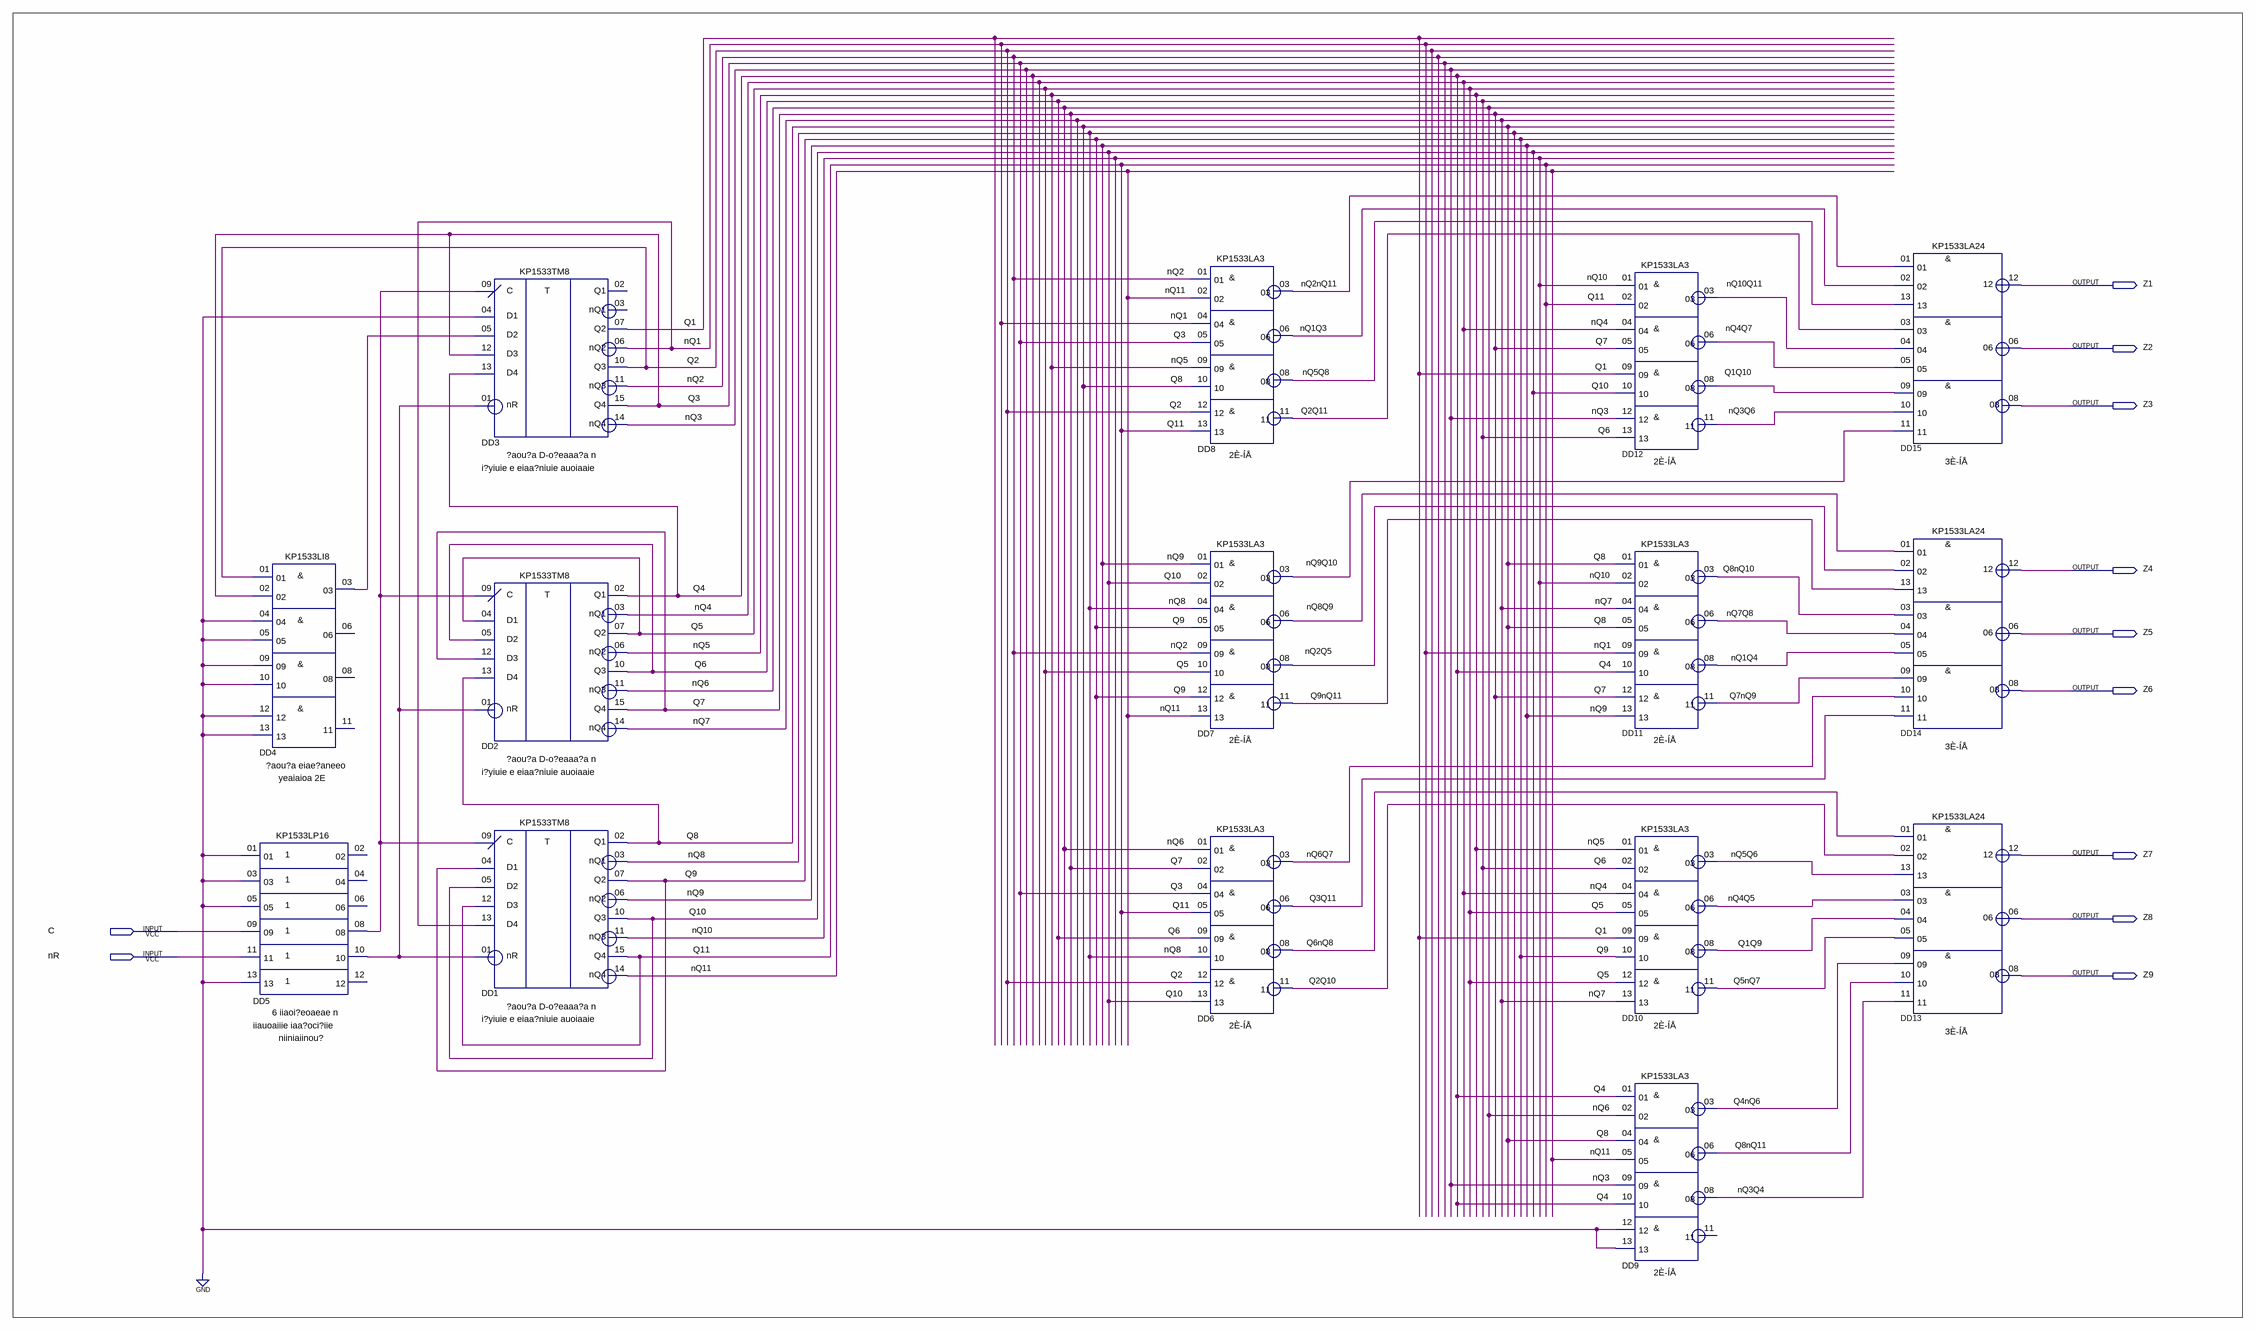
[diagram p0: schematic sheet]
// Quartus schematic PK_NAND.bdf as structural Verilog: 15 symbols, 11 pins
module PK_NAND (
  input  C,
  input  nR,
  output Z1,
  output Z2,
  output Z3,
  output Z4,
  output Z5,
  output Z6,
  output Z7,
  output Z8,
  output Z9
);

  wire DD4_03, DD5_08, DD5_10, nQ1, nQ1Q3, nQ1Q4, nQ2, nQ2nQ11, nQ2Q5, nQ3, nQ3Q4, nQ3Q6, nQ4, nQ4Q5, nQ4Q7,
       nQ5, nQ5Q6, nQ5Q8, nQ6, nQ6Q7, nQ7, nQ7Q8, nQ8, nQ8Q9, nQ9, nQ9Q10, nQ10, nQ10Q11, nQ11, Q1, Q1Q9,
       Q1Q10, Q2, Q2Q10, Q2Q11, Q3, Q3Q11, Q4, Q4nQ6, Q5, Q5nQ7, Q6, Q6nQ8, Q7, Q7nQ9, Q8, Q8nQ10, Q8nQ11,
       Q9, Q9nQ11, Q10, Q11;

  KP1533LI8 DD4 (
    .\01 (Q2), .\02 (Q3), .\04 (1'b0), .\05 (1'b0), .\09 (1'b0), .\10 (1'b0), .\12 (1'b0), .\13 (1'b0),
    .\03 (DD4_03));  // open: 06, 08, 11
  KP1533LP16 DD5 (
    .\01 (1'b0), .\03 (1'b0), .\05 (1'b0), .\09 (C), .\11 (nR), .\13 (1'b0), .\08 (DD5_08), .\10 (DD5_10));  // open: 02, 04, 06, 12
  KP1533TM8 DD3 (
    .nR(DD5_10), .C(DD5_08), .D1(1'b0), .D2(DD4_03), .D3(Q3), .D4(Q4), .Q2(Q1), .nQ2(nQ1), .Q3(Q2),
    .nQ3(nQ2), .Q4(Q3), .nQ4(nQ3));  // open: Q1, nQ1
  KP1533TM8 DD2 (
    .nR(DD5_10), .C(DD5_08), .D1(Q5), .D2(Q6), .D3(Q7), .D4(Q8), .Q1(Q4), .nQ1(nQ4), .Q2(Q5), .nQ2(nQ5),
    .Q3(Q6), .nQ3(nQ6), .Q4(Q7), .nQ4(nQ7));
  KP1533TM8 DD1 (
    .nR(DD5_10), .C(DD5_08), .D1(Q9), .D2(Q10), .D3(Q11), .D4(nQ1), .Q1(Q8), .nQ1(nQ8), .Q2(Q9), .nQ2(nQ9),
    .Q3(Q10), .nQ3(nQ10), .Q4(Q11), .nQ4(nQ11));
  KP1533LA3 DD8 (
    .\01 (nQ2), .\02 (nQ11), .\04 (nQ1), .\05 (Q3), .\09 (nQ5), .\10 (Q8), .\12 (Q2), .\13 (Q11),
    .\03 (nQ2nQ11), .\06 (nQ1Q3), .\08 (nQ5Q8), .\11 (Q2Q11));
  KP1533LA3 DD7 (
    .\01 (nQ9), .\02 (Q10), .\04 (nQ8), .\05 (Q9), .\09 (nQ2), .\10 (Q5), .\12 (Q9), .\13 (nQ11),
    .\03 (nQ9Q10), .\06 (nQ8Q9), .\08 (nQ2Q5), .\11 (Q9nQ11));
  KP1533LA3 DD6 (
    .\01 (nQ6), .\02 (Q7), .\04 (Q3), .\05 (Q11), .\09 (Q6), .\10 (nQ8), .\12 (Q2), .\13 (Q10), .\03 (nQ6Q7),
    .\06 (Q3Q11), .\08 (Q6nQ8), .\11 (Q2Q10));
  KP1533LA3 DD12 (
    .\01 (nQ10), .\02 (Q11), .\04 (nQ4), .\05 (Q7), .\09 (Q1), .\10 (Q10), .\12 (nQ3), .\13 (Q6),
    .\03 (nQ10Q11), .\06 (nQ4Q7), .\08 (Q1Q10), .\11 (nQ3Q6));
  KP1533LA3 DD11 (
    .\01 (Q8), .\02 (nQ10), .\04 (nQ7), .\05 (Q8), .\09 (nQ1), .\10 (Q4), .\12 (Q7), .\13 (nQ9),
    .\03 (Q8nQ10), .\06 (nQ7Q8), .\08 (nQ1Q4), .\11 (Q7nQ9));
  KP1533LA3 DD10 (
    .\01 (nQ5), .\02 (Q6), .\04 (nQ4), .\05 (Q5), .\09 (Q1), .\10 (Q9), .\12 (Q5), .\13 (nQ7), .\03 (nQ5Q6),
    .\06 (nQ4Q5), .\08 (Q1Q9), .\11 (Q5nQ7));
  KP1533LA3 DD9 (
    .\01 (Q4), .\02 (nQ6), .\04 (Q8), .\05 (nQ11), .\09 (nQ3), .\10 (Q4), .\12 (1'b0), .\13 (1'b0),
    .\03 (Q4nQ6), .\06 (Q8nQ11), .\08 (nQ3Q4));  // open: 11
  KP1533LA24 DD15 (
    .\01 (nQ2nQ11), .\02 (nQ1Q3), .\13 (nQ5Q8), .\03 (Q2Q11), .\04 (nQ10Q11), .\05 (nQ4Q7), .\09 (Q1Q10),
    .\10 (nQ3Q6), .\11 (nQ9Q10), .\12 (Z1), .\06 (Z2), .\08 (Z3));
  KP1533LA24 DD14 (
    .\01 (nQ8Q9), .\02 (nQ2Q5), .\13 (Q9nQ11), .\03 (Q8nQ10), .\04 (nQ7Q8), .\05 (nQ1Q4), .\09 (Q7nQ9),
    .\10 (nQ6Q7), .\11 (Q3Q11), .\12 (Z4), .\06 (Z5), .\08 (Z6));
  KP1533LA24 DD13 (
    .\01 (Q6nQ8), .\02 (Q2Q10), .\13 (nQ5Q6), .\03 (nQ4Q5), .\04 (Q1Q9), .\05 (Q5nQ7), .\09 (Q4nQ6),
    .\10 (Q8nQ11), .\11 (nQ3Q4), .\12 (Z7), .\06 (Z8), .\08 (Z9));
endmodule
